# EAGLE design ThumbLCDBase (EAGLE 5.07)
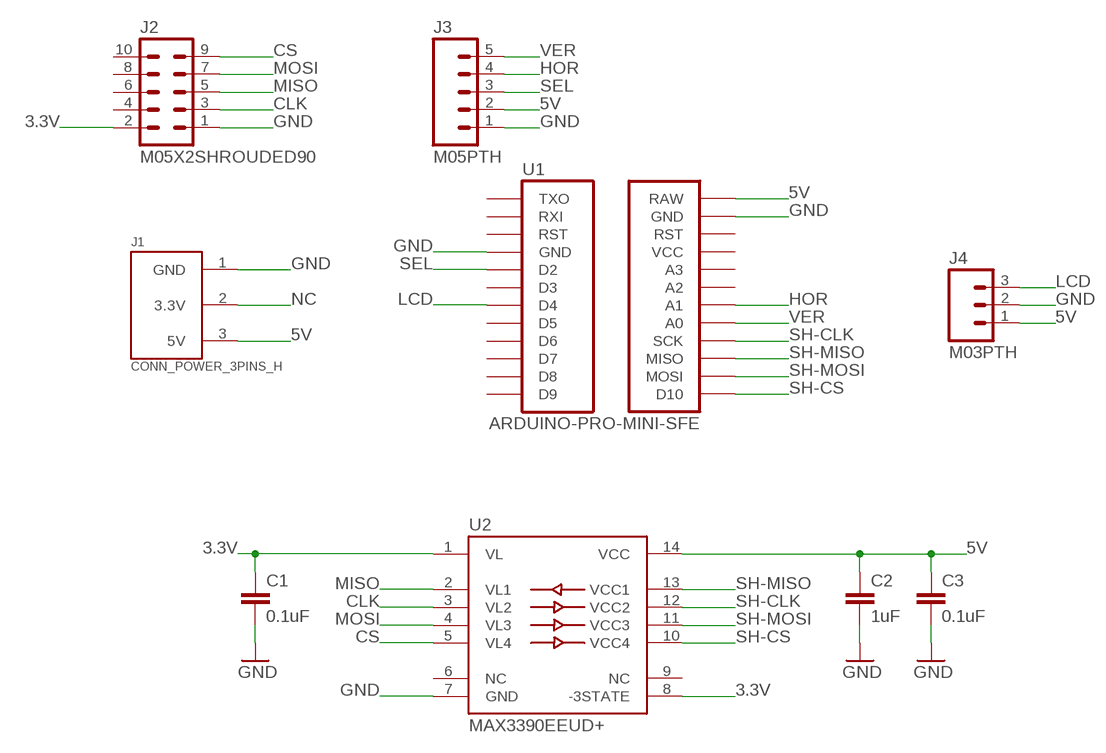
[diagram p0: schematic, sheet 1]

## Parts
C1  0.1uF  CAP0805  [C0805]
C2  1uF  CAP0805  [C0805]
C3  0.1uF  CAP0805  [C0805]
J1  CONN_POWER_3PINS_H  [3PINS_3.81MM_90DEG]
J2  M05X2SHROUDED90  [2X05/90/SHROUDED]
J3  M05PTH  [1X05]
J4  M03PTH  [1X03]
U1  ARDUINO-PRO-MINI-SFE  [ARDUINO-PRO-MINI]
U2  MAX3390EEUD+  [TSSOP-14]

## Nets
3.3V: C1.1 J2.2 U2.1(VL) U2.8(-3STATE)
5V: C2.1 C3.1 J1.3(5V) J3.2 J4.1 U1.P$23(RAW) U2.14(VCC)
CLK: J2.3 U2.3(VL2)
CS: J2.9 U2.5(VL4)
GND: C1.2 C2.2 C3.2 J1.1(GND) J2.1 J3.1 J4.2 U1.P$18(GND) U1.P$21(GND) U2.7(GND)
HOR: J3.4 U1.P$11(A1)
LCD: J4.3 U1.P$12(D4)
MISO: J2.5 U2.2(VL1)
MOSI: J2.7 U2.4(VL3)
NC: J1.2(3.3V)
SEL: J3.3 U1.P$16(D2)
SH-CLK: U1.P$7(SCK) U2.12(VCC2)
SH-CS: U1.P$1(D10) U2.10(VCC4)
SH-MISO: U1.P$5(MISO) U2.13(VCC1)
SH-MOSI: U1.P$3(MOSI) U2.11(VCC3)
VER: J3.5 U1.P$9(A0)
Unconnected: J2.4 J2.6 J2.8 J2.10 U1.P$2(D9) U1.P$4(D8) U1.P$6(D7) U1.P$8(D6) U1.P$10(D5) U1.P$13(A2) U1.P$14(D3) U1.P$15(A3) U1.P$17(VCC) U1.P$19(RST) U1.P$20(RST) U1.P$22(RXI) U1.P$24(TXO) U2.6(NC) U2.9(NC)

## Library data of the parts
C1-C3 = Robot:CAP: CAPACITOR
J1 = Robot:CONN_POWER_3PINS: POWER CONNECTOR for logic boards. Provides 3.3V and 5V.
J2 = Robot:M05X2: 10-PIN DUAL ROW HEADER Standard 10-pin dual row 0.1" header.
J3 = Robot:M05: 5-PIN HEADER Standard 5-pin 0.1" header.
J4 = Robot:M03: 3-PIN HEADER Standard 3-pin 0.1" header.
U1 = Robot:ARDUINO-PRO-MINI: Arduino Pro Mini This is SparkFun's version of the Arduino Pro Mini board.
U2 = Robot:MAX3390E: Low-Voltage Level Translator Page du fabricant: http://www.maxim-ic.com/quick_view2.cfm/qv_pk/3253 Datasheet: http://datasheets.maxim-ic.com/en/ds/MAX3372E-MAX3393E.pdf

## Board
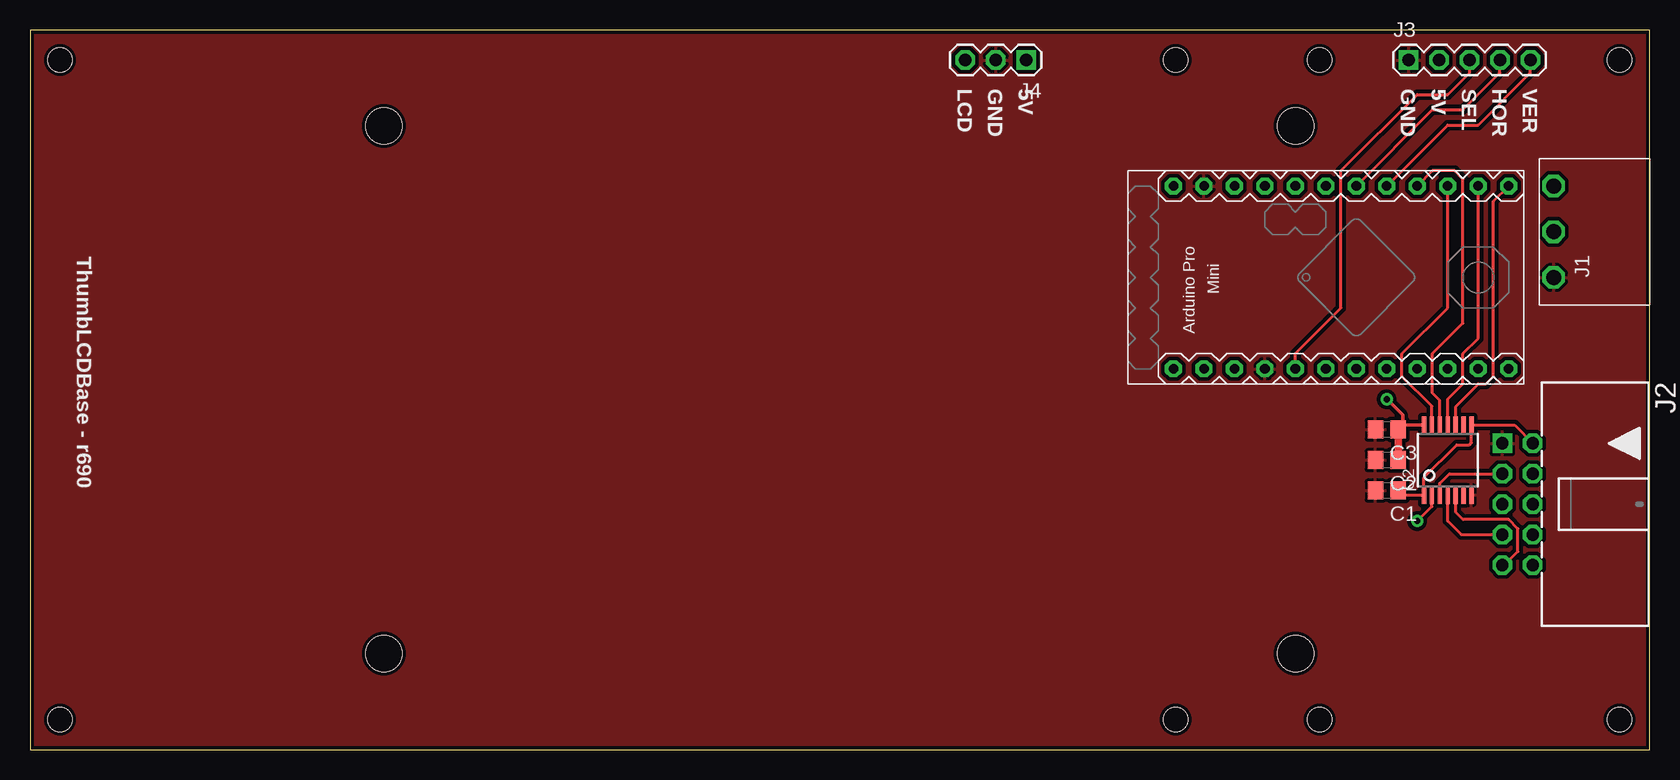
[diagram p1: board, top side]
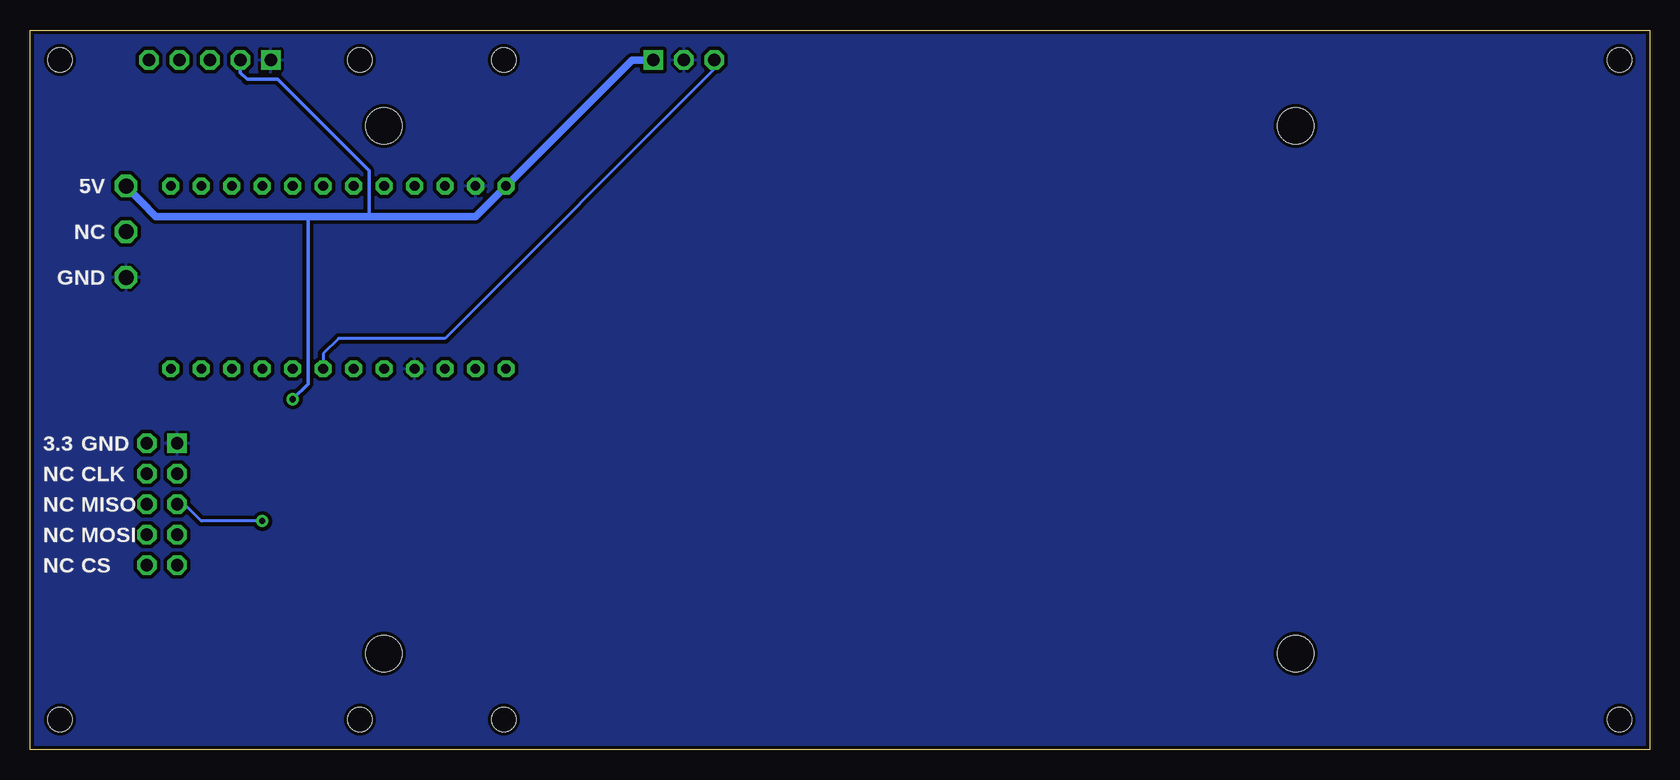
[diagram p2: board, bottom side, seen from below]

Size 135 x 60 mm. Coordinates in mm from the lower left corner, seen from the top.
Outline: 0,0 135,0 135,60 0,60 0,0
Copper layers (1*16): Top 0.035mm / dielectric 1.5mm / Bottom 0.035mm
Design rules "SparkFun": minimum track width 8mil, minimum drill 20mil, track to track 8mil, track to pad 8mil, pad to pad 8mil, via to via 8mil, smd to smd 8mil, copper to edge 10mil, drill to drill 8mil, minimum pad ring 12mil, minimum via ring 10mil, stop-mask expansion 4mil, vias tented up to drill 25mil, thermal gap 10mil
Holes 2 mm at 2.5,2.5 2.5,57.5 95.5,57.5 132.5,57.5 95.5,2.5 132.5,2.5 107.5,57.5 107.5,2.5
Holes 3 mm at 105.5,8 105.5,52 29.5,52 29.5,8

### Footprints (pad centres in the part's own frame; a part is rotated, then mirrored left to right if it is on the bottom)
C0805 = smd 1.3 x 1.5: 1 -0.95,0; 2 0.95,0
3PINS_3.81MM_90DEG = drill 1.25 octagon: 1 -3.81,3; 2 0,3; 3 3.81,3
2X05/90/SHROUDED = drill 1.016 square: 1 -5.08,-1.27 | drill 1.016 octagon: 2 -5.08,1.27; 3 -2.54,-1.27; 4 -2.54,1.27; 5 0,-1.27; 6 0,1.27; 7 2.54,-1.27; 8 2.54,1.27; 9 5.08,-1.27; 10 5.08,1.27
1X05 = drill 1.016 square: 1 0,0 | drill 1.016 octagon: 2 2.54,0; 3 5.08,0; 4 7.62,0; 5 10.16,0
1X03 = drill 1.016 square: 1 -2.54,0 | drill 1.016 octagon: 2 0,0; 3 2.54,0
ARDUINO-PRO-MINI = drill 0.8 octagon: P$1 16.51,1.27; P$2 1.27,1.27; P$3 16.51,3.81; P$4 1.27,3.81; P$5 16.51,6.35; P$6 1.27,6.35; P$7 16.51,8.89; P$8 1.27,8.89; P$9 16.51,11.43; P$10 1.27,11.43; P$11 16.51,13.97; P$12 1.27,13.97; P$13 16.51,16.51; P$14 1.27,16.51; P$15 16.51,19.05; P$16 1.27,19.05; P$17 16.51,21.59; P$18 1.27,21.59; P$19 16.51,24.13; P$20 1.27,24.13; P$21 16.51,26.67; P$22 1.27,26.67; P$23 16.51,29.21; P$24 1.27,29.21
TSSOP-14 = smd 1.422 x 0.356: 1 -2.921,1.981; 2 -2.921,1.321; 3 -2.921,0.66; 4 -2.921,0; 5 -2.921,-0.66; 6 -2.921,-1.321; 7 -2.921,-1.981; 8 2.921,-1.981; 9 2.921,-1.321; 10 2.921,-0.66; 11 2.921,0; 12 2.921,0.66; 13 2.921,1.321; 14 2.921,1.981

### Placement (x,y rotation side)
C1  113.1,21.59 180 top
C2  113.1,24.13 180 top
C3  113.1,26.67 180 top
J1  130,43.18 90 top
J2  124,20.46 270 top
J3  114.92,57.5 0 top
J4  80.5,57.5 180 top
U1  124.53,30.48 90 top
U2  118.18,24.13 90 top

### Tracks (layer width: path | path; a pad name or v marks a point on that pad's centre or on a via)
3.3V
  Top 0.254: C1.1 114.43,21.21 U2.1 116.2,22.67 118.92,25.4 119.98,25.4 120.16,25.59 U2.8 123.76,27.05 J2.2
5V  (via drill 0.51)
  Top 0.254: C3.1 114.43,27.05
  Top 0.305: v113.1,29.21 114.43,27.88 114.43,27.05 U2.14
  Top 0.61: C2.1 C3.1
  Bottom 0.305: J3.2 117.46,56.43 116.91,55.88 114.37,55.88 106.75,48.26 106.75,44.45 | 111.83,44.45 111.83,30.48 v113.1,29.21
  Bottom 0.61: J1.3 124.53,44.45 111.83,44.45 106.75,44.45 97.86,44.45 U1.P$23 84.81,57.5 J4.1
CLK
  Top 0.254: J2.3 118.32,23 117.52,22.2 U2.3
CS
  Top 0.254: J2.9 122.89,15.38 124.02,16.51 124.02,18.41 123.26,19.18 119.45,19.18 118.84,19.79 U2.5
GND
  pour Bottom (isolate 0.305): 0,0 0,60 135,60 135,0
  pour Top (isolate 0.305): 0,0 135,0 135,60 0,60
HOR
  Top 0.254: U1.P$11 116.91,53.34 119.45,53.34 122.54,56.43 J3.4
LCD
  Bottom 0.254: U1.P$12 110.56,33.02 109.29,34.29 100.4,34.29 77.96,56.73 J4.3
MISO  (via drill 0.51)
  Top 0.254: U2.2 116.86,20.27 v115.64,19.05
  Bottom 0.254: J2.5 122.13,20.46 120.72,19.05 v115.64,19.05
MOSI
  Top 0.254: U2.4 118.18,19.05 119.31,17.92 J2.7
SEL
  Top 0.254: J3.3 120,56.43 118.18,54.61 115.64,54.61 109.29,48.26 109.29,36.83 105.48,33.02 U1.P$16
SH-CLK
  Top 0.254: U1.P$7 116.91,48.26 118.77,48.26 119.45,47.58 119.45,35.56 116.91,33.02 116.91,29.72 117.52,29.11 U2.12
SH-CS
  Top 0.254: U1.P$1 121.99,45.72 121.99,31.11 121.35,30.48 120.72,30.48 118.84,28.6 U2.10
SH-MISO
  Top 0.254: U2.13 116.86,28.63 114.37,31.11 114.37,33.02 118.18,36.83 U1.P$5
SH-MOSI
  Top 0.254: U1.P$3 120.72,34.29 119.45,33.02 119.45,30.48 118.18,29.21 U2.11
VER
  Top 0.254: U1.P$9 118.18,52.07 120.72,52.07 125.08,56.43 J3.5

### Text on the board
tPlace: LCD | GND | 5V | GND | 5V | SEL | HOR | VER | ThumbLCDBase - r690
bPlace: 5V | NC | GND | GND | 3.3 | CLK | NC | MISO | NC | MOSI | NC | CS | NC